# Altium project PAY_IFB.PrjPcb (part 4 of 7)

## Sheet SAMA7D65_MPU.SchDoc
size A3; SheetNumber: 7; SheetTotal: 23
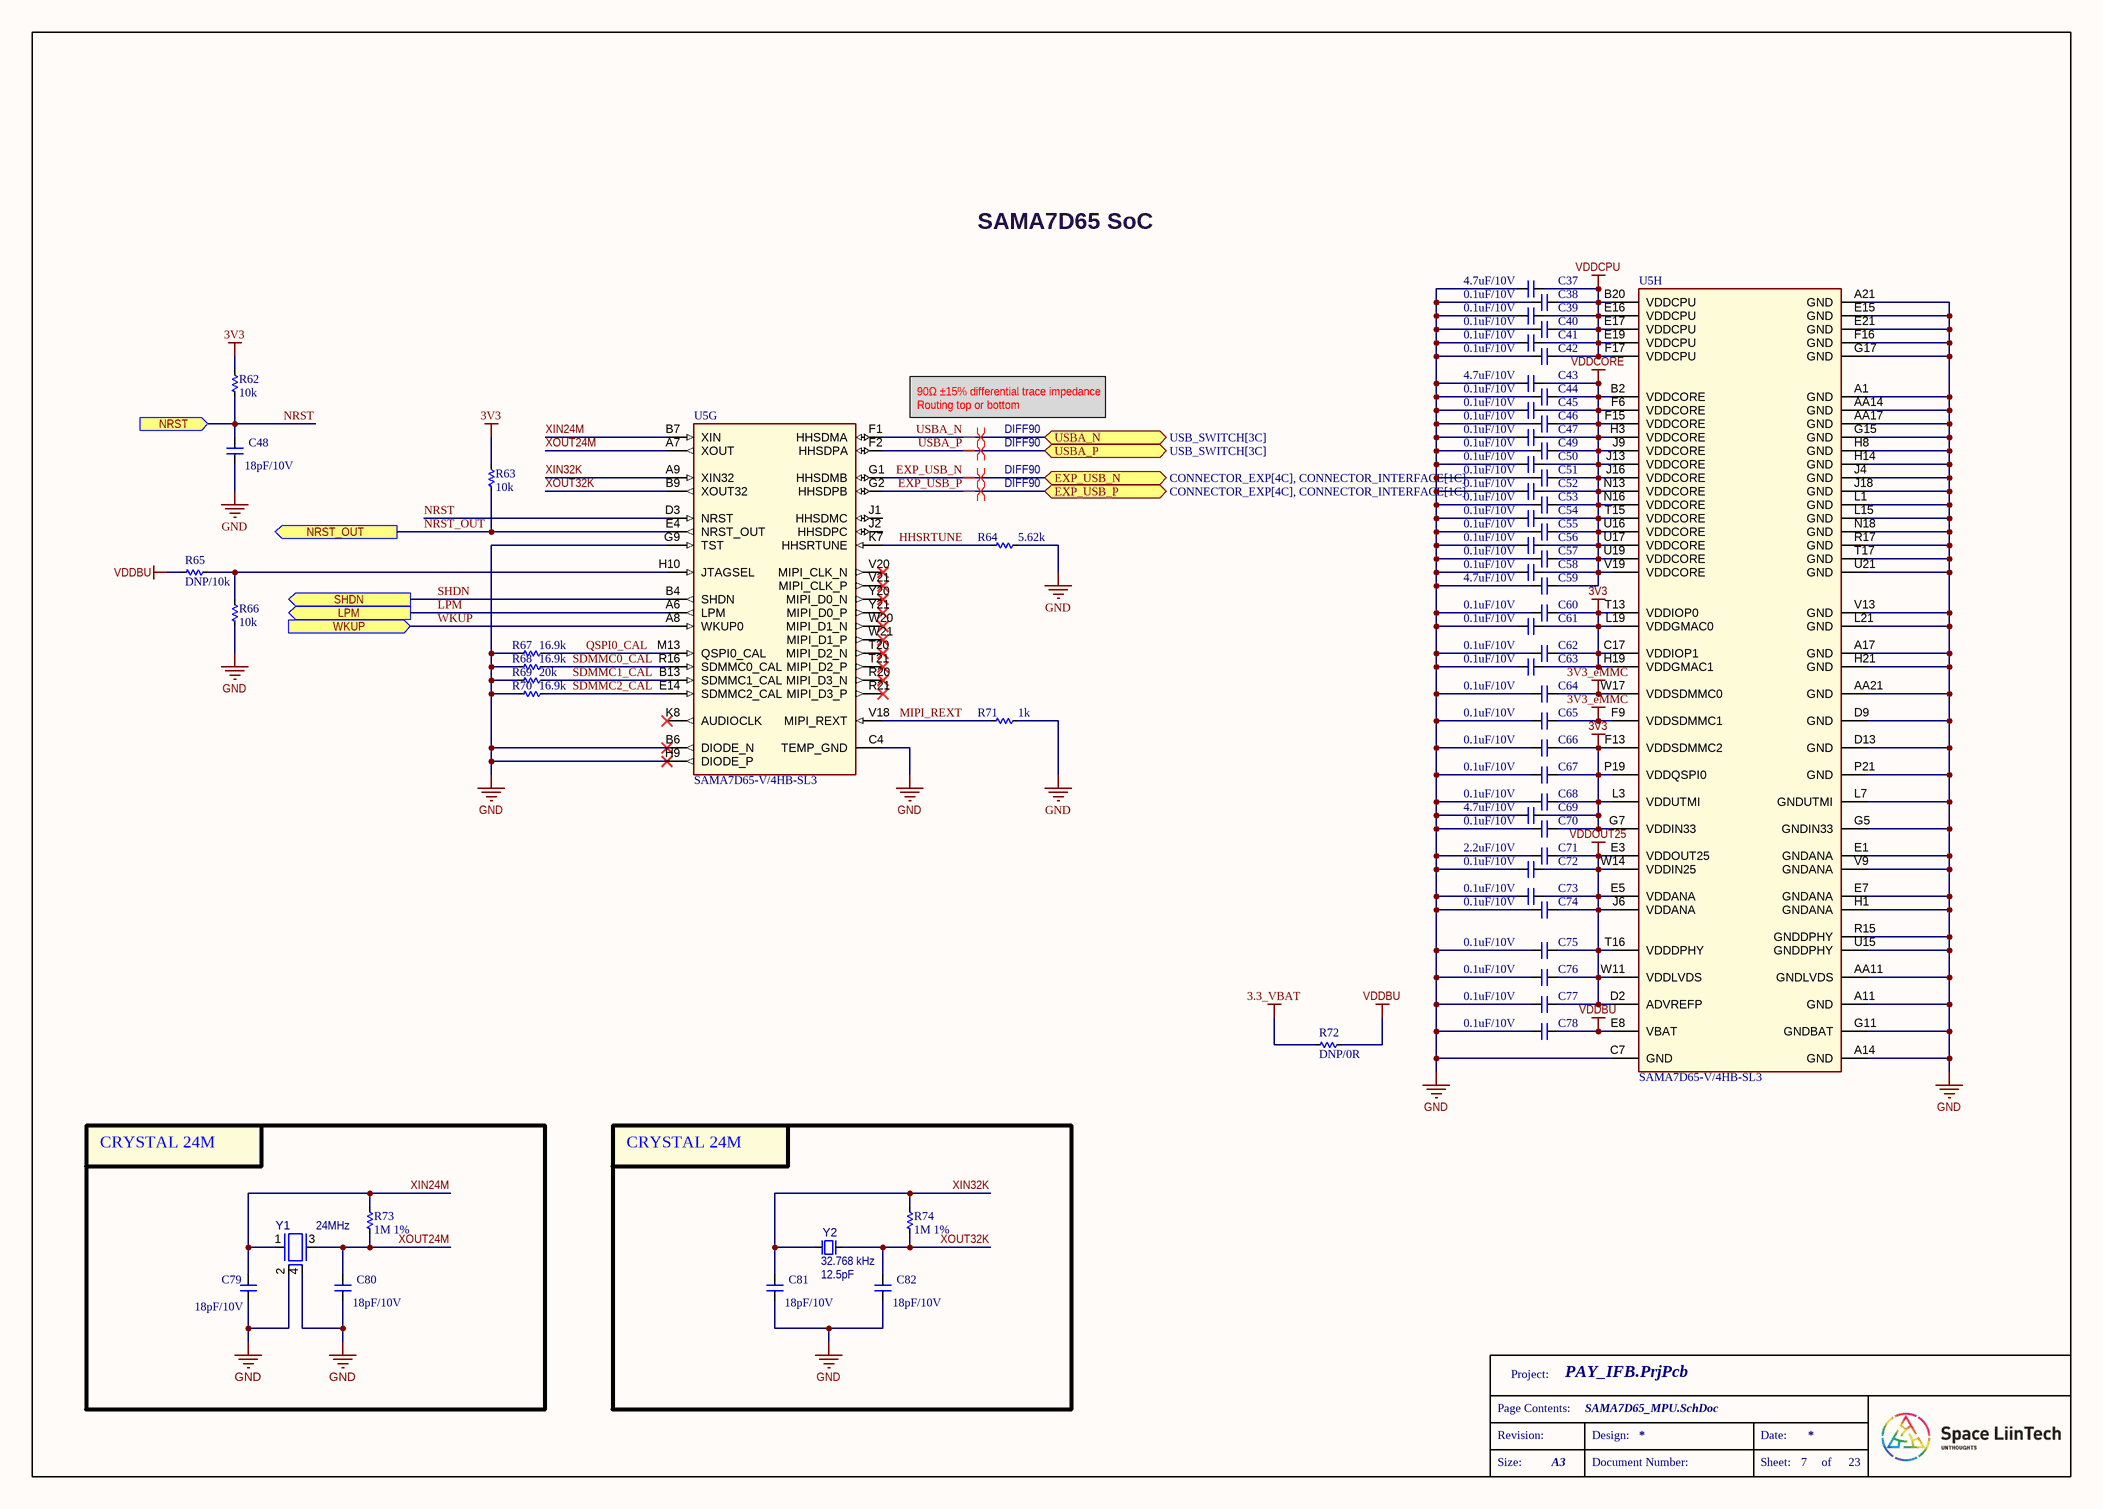
[diagram p7: SAMA7D65_MPU.SchDoc]

### Parts
C37  4.7uF/10V  [CAP_C_1005X50_L]
C38  0.1uF/10V  [CAP_C_0603x30]
C39  0.1uF/10V  [CAP_C_0603x30]
C40  0.1uF/10V  [CAP_C_0603x30]
C41  0.1uF/10V  [CAP_C_0603x30]
C42  0.1uF/10V  [CAP_C_0603x30]
C43  4.7uF/10V  [CAP_C_1005X50_L]
C44  0.1uF/10V  [CAP_C_0603x30]
C45  0.1uF/10V  [CAP_C_0603x30]
C46  0.1uF/10V  [CAP_C_0603x30]
C47  0.1uF/10V  [CAP_C_0603x30]
C48  18pF/10V  [CAP_C_0603x30]
C49  0.1uF/10V  [CAP_C_0603x30]
C50  0.1uF/10V  [CAP_C_0603x30]
C51  0.1uF/10V  [CAP_C_0603x30]
C52  0.1uF/10V  [CAP_C_0603x30]
C53  0.1uF/10V  [CAP_C_0603x30]
C54  0.1uF/10V  [CAP_C_0603x30]
C55  0.1uF/10V  [CAP_C_0603x30]
C56  0.1uF/10V  [CAP_C_0603x30]
C57  0.1uF/10V  [CAP_C_0603x30]
C58  0.1uF/10V  [CAP_C_0603x30]
C59  4.7uF/10V  [CAP_C_1005X50_L]
C60  0.1uF/10V  [CAP_C_0603x30]
C61  0.1uF/10V  [CAP_C_0603x30]
C62  0.1uF/10V  [CAP_C_0603x30]
C63  0.1uF/10V  [CAP_C_0603x30]
C64  0.1uF/10V  [CAP_C_0603x30]
C65  0.1uF/10V  [CAP_C_0603x30]
C66  0.1uF/10V  [CAP_C_0603x30]
C67  0.1uF/10V  [CAP_C_0603x30]
C68  0.1uF/10V  [CAP_C_0603x30]
C69  4.7uF/10V  [CAP_C_1005X50_L]
C70  0.1uF/10V  [CAP_C_0603x30]
C71  2.2uF/10V  [CAP_C_1005X50_L]
C72  0.1uF/10V  [CAP_C_0603x30]
C73  0.1uF/10V  [CAP_C_0603x30]
C74  0.1uF/10V  [CAP_C_0603x30]
C75  0.1uF/10V  [CAP_C_0603x30]
C76  0.1uF/10V  [CAP_C_0603x30]
C77  0.1uF/10V  [CAP_C_0603x30]
C78  0.1uF/10V  [CAP_C_0603x30]
C79  18pF/10V  [CAP_C_0603x30]
C80  18pF/10V  [CAP_C_0603x30]
C81  18pF/10V  [CAP_C_0603x30]
C82  18pF/10V  [CAP_C_0603x30]
R62  10k  [RES_C_1005x30_L]
R63  10k  [RES_C_1005x30_L]
R64  5.62k  [RES_C_1005x30_L]
R65  DNP/10k  [RES_C_1005x30_L]
R66  10k  [RES_C_1005x30_L]
R67  16.9k  [RES_C_0603X30]
R68  16.9k  [RES_C_0603X30]
R69  20k  [RES_C_0603X30]
R70  16.9k  [RES_C_0603X30]
R71  1k  [RES_C_1005x30_L]
R72  DNP/0R  [RES_C_1005x30_L]
R73  1M 1%  [RES_C_1005x30_L]
R74  1M 1%  [RES_C_1005x30_L]
U5  value SAMA7D65-V/4HB-SL3  [TFBGA-343_14x14]  (hidden comment: SAMA7D65)  (parts G,H of 8)
Y1  value 24MHz  [XTAL_ECS2401037B2JTNTR]  (hidden comment: Crystal 4 Pins)
Y2  value 32.768 kHz  Load Capacitance: 12.5pF  [CRYSTAL_FC-12M_L2.05W1.2H0.6]  (hidden comment: Crystal 2 Pins)

### Blocks framed on the sheet
CRYSTAL 24M: C79 C80 R73 Y1
CRYSTAL 24M: C81 C82 R74 Y2

### Ports
EXP_USB_N (bidir, see CONNECTOR_EXP[4C], CONNECTOR_INTERFACE[1C]), EXP_USB_P (bidir, see CONNECTOR_EXP[4C], CONNECTOR_INTERFACE[1C]), LPM (out, see SAMA7D65_PMIC[1A]), NRST (in, see BUTTON_LED[6B], SAMA7D65_PMIC[1B], WATCHDOG[5B]), NRST_OUT (out), SHDN (out, see SAMA7D65_PMIC[1A]), USBA_N (bidir, see USB_SWITCH[3C]), USBA_P (bidir, see USB_SWITCH[3C]), WKUP (in, see SAMA7D65_PMIC[1B])

### Nets
3.3_VBAT: R72.1
3V3: C60.2 C61.2 C62.2 C63.2 C66.2 C67.2 C68.2 C69.2 C70.2 R62.1 R63.1 U5.C17(VDDIOP1) U5.F13(VDDSDMMC2) U5.G7(VDDIN33) U5.H19(VDDGMAC1) U5.L3(VDDUTMI) U5.L19(VDDGMAC0) U5.P19(VDDQSPI0) U5.T13(VDDIOP0)
3V3_eMMC: C64.2 C65.2 U5.F9(VDDSDMMC1) U5.W17(VDDSDMMC0)
GND: C37.1 C38.1 C39.1 C40.1 C41.1 C42.1 C43.1 C44.1 C45.1 C46.1 C47.1 C48.2 C49.1 C50.1 C51.1 C52.1 C53.1 C54.1 C55.1 C56.1 C57.1 C58.1 C59.1 C60.1 C61.1 C62.1 C63.1 C64.1 C65.1 C66.1 C67.1 C68.1 C69.1 C70.1 C71.1 C72.1 C73.1 C74.1 C75.1 C76.1 C77.1 C78.1 C79.2 C80.2 C81.2 C82.2 R64.2 R66.1 R67.1 R68.1 R69.1 R70.1 R71.2 U5.A1(GND) U5.A11(GND) U5.A14(GND) U5.A17(GND) U5.A21(GND) U5.AA11(GNDLVDS) U5.AA14(GND) U5.AA17(GND) U5.AA21(GND) U5.B6(DIODE_N) U5.C4(TEMP_GND) U5.C7(GND) U5.D9(GND) U5.D13(GND) U5.E1(GNDANA) U5.E7(GNDANA) U5.E15(GND) U5.E21(GND) U5.F16(GND) U5.G5(GNDIN33) U5.G9(TST) U5.G11(GNDBAT) U5.G15(GND) U5.G17(GND) U5.H1(GNDANA) U5.H8(GND) U5.H9(DIODE_P) U5.H14(GND) U5.H21(GND) U5.J4(GND) U5.J18(GND) U5.L1(GND) U5.L7(GNDUTMI) U5.L15(GND) U5.L21(GND) U5.N18(GND) U5.P21(GND) U5.R15(GNDDPHY) U5.R17(GND) U5.T17(GND) U5.U15(GNDDPHY) U5.U21(GND) U5.V9(GNDANA) U5.V13(GND) Y1.2(GND) Y1.4(GND)
VDDBU: C78.2 R65.2 R72.2 U5.E8(VBAT)
VDDCORE: C43.2 C44.2 C45.2 C46.2 C47.2 C49.2 C50.2 C51.2 C52.2 C53.2 C54.2 C55.2 C56.2 C57.2 C58.2 C59.2 U5.B2(VDDCORE) U5.F6(VDDCORE) U5.F15(VDDCORE) U5.H3(VDDCORE) U5.J9(VDDCORE) U5.J13(VDDCORE) U5.J16(VDDCORE) U5.N13(VDDCORE) U5.N16(VDDCORE) U5.T15(VDDCORE) U5.U16(VDDCORE) U5.U17(VDDCORE) U5.U19(VDDCORE) U5.V19(VDDCORE)
VDDCPU: C37.2 C38.2 C39.2 C40.2 C41.2 C42.2 U5.B20(VDDCPU) U5.E16(VDDCPU) U5.E17(VDDCPU) U5.E19(VDDCPU) U5.F17(VDDCPU)
VDDOUT25: C71.2 C72.2 C73.2 C74.2 C75.2 C76.2 C77.2 U5.D2(ADVREFP) U5.E3(VDDOUT25) U5.E5(VDDANA) U5.J6(VDDANA) U5.T16(VDDDPHY) U5.W11(VDDLVDS) U5.W14(VDDIN25)
EXP_USB_N: U5.G1(HHSDMB) ; port EXP_USB_N
EXP_USB_P: U5.G2(HHSDPB) ; port EXP_USB_P
HHSRTUNE: R64.1 U5.K7(HHSRTUNE)
LPM: U5.A6(LPM) ; port LPM
MIPI_REXT: R71.1 U5.V18(MIPI_REXT)
NRST: C48.1 R62.2 U5.D3(NRST) ; port NRST
NRST_OUT: R63.2 U5.E4(NRST_OUT) ; port NRST_OUT
QSPI0_CAL: R67.2 U5.M13(QSPI0_CAL)
SDMMC0_CAL: R68.2 U5.R16(SDMMC0_CAL)
SDMMC1_CAL: R69.2 U5.B13(SDMMC1_CAL)
SDMMC2_CAL: R70.2 U5.E14(SDMMC2_CAL)
SHDN: U5.B4(SHDN) ; port SHDN
USBA_N: U5.F1(HHSDMA) ; port USBA_N
USBA_P: U5.F2(HHSDPA) ; port USBA_P
WKUP: U5.A8(WKUP0) ; port WKUP
XIN24M: C79.1 R73.2 U5.B7(XIN) Y1.1(Osc1)
XIN32K: C81.1 R74.2 U5.A9(XIN32) Y2.1(Osc1)
XOUT24M: C80.1 R73.1 U5.A7(XOUT) Y1.3(Osc2)
XOUT32K: C82.1 R74.1 U5.B9(XOUT32) Y2.2(Osc2)
NetR65_1: R65.1 R66.2 U5.H10(JTAGSEL)

Not connected (* = marked no-connect by the designer): U5 J1(HHSDMC) J2(HHSDPC) K8(AUDIOCLK)* R20(MIPI_D3_N)* R21(MIPI_D3_P)* T20(MIPI_D2_N)* T21(MIPI_D2_P)* V20(MIPI_CLK_N)* V21(MIPI_CLK_P)* W20(MIPI_D1_N)* W21(MIPI_D1_P)* Y20(MIPI_D0_N)* Y21(MIPI_D0_P)*

### Layout directives
differential pair; differential pair class DIFF90; net class DIFF90; rule Matched Net Lengths [Tolerance = 4mil]: EXP_USB_N, EXP_USB_P, USBA_N, USBA_P

### Notes on the sheet
- SAMA7D65 SoC
- 90Ω ±15% differential trace impedance
  Routing top or bottom
- Project:
- Page Contents:
- Revision:
- Design:
- Date:
- Size:
- A3
- Document Number:
- Sheet:
- of

### Library data of the parts
C37-C82 = _CAP_C_2: CAP CHIP
R62-R74 = _RES_B_2: RES
U5 = SAMA7D65: SAMA7D65 MPU 1000MHz Cortex-A7 TFBGA-343; Manufacturer 1: Microchip Technology; Description_: MCHP MPU 32-BIT Cortex-A7 1000MHz 128kB SAMA7D65-V/4HB-SL3 TFBGA-343; Populated: YES; MCHP-ID: IC2674; Symbol: SAMA7D65-TFBGA-343; Dev Tools Status: Design; Owner: Ciprian Abramov; Restricted Sourcing: No; Manufacturer Part Number 1: SAMA7D65-V/4HB-SL3; Type: 32-Bit MPU; Status: MCL Design; Revision: 1; Category: MCHP-Microcontroller; ComponentLink1URL: https://www.microchip.com/sitesearch/search/Product%20and%20Development%20Tools/SAMA7D65-V/4HB-SL3; ComponentLink1Description: SVN Datasheet; ComponentLink2Description: Local Datasheet; ComponentLink3URL: C:\ALTIUM_WORK\00001_MCHP-CDB\Library\LibraryRefs\SAMA7D65-TFBGA-343.SchLib; ComponentLink3Description: Open Symbol; ComponentLink4URL: C:\ALTIUM_WORK\00001_MCHP-CDB\Library\Footprints\TFBGA-343_14x14.PcbLib; ComponentLink4Description: Open Footprint; ComponentLink5Description: Open Footprint 2; ComponentLink6Description: Open Footprint 3; ComponentLink7Description: Open Footprint 4; Supplier 1: Microchip Technology; Supplier Part Number 1: SAMA7D65-V/4HB-SL3; Operating Temperature: -40C to +105C; Quantity Override: 1
Y1 = ECS-240-10-37B2-JTN-TR: CRYSTAL 24 MHZ 10PF SMD; Manufacturer 1: ECS Inc; MCHP-ID: OSC1299; Description_: CRYSTAL 24MHz 10pF SMD L2W1.6H0.5; Dev Tools Status: Design; Owner: Ciprian Abramov; Tolerance: 20ppm; Populated: YES; Revision: 1; Symbol: Crystal 4 Pins; Status: MCL Design; ComponentLink1URL: https://chn-vm-apps.microchip.com/mchprepo/parts/Datasheets/ECX-1637B2.pdf; ComponentLink1Description: SVN Datasheet; ComponentLink2URL: C:\ALTIUM_WORK\00001_MCHP-CDB\Datasheets\ECX-1637B2.pdf; ComponentLink2Description: Local Datasheet; ComponentLink3URL: C:\ALTIUM_WORK\00001_MCHP-CDB\Library\LibraryRefs\Crystal 4 Pins.SchLib; ComponentLink3Description: Open Symbol; ComponentLink4URL: C:\ALTIUM_WORK\00001_MCHP-CDB\Library\Footprints\CRYSTAL_L2.0W1.6H0.5_FA-128.PcbLib; ComponentLink4Description: Open Footprint; ComponentLink5Description: Open Footprint 2; ComponentLink6Description: Open Footprint 3; ComponentLink7Description: Open Footprint 4; Operating Temperature: -40C to +85C; Package: L2.0W1.6H0.5; Type: Crystal; Category: Crystal/Oscillator; Load Capacitance: 10pF; Manufacturer Part Number 1: ECS-240-10-37B2-JTN-TR; Supplier 1: Digi-Key; Supplier Part Number 1: 50-ECS-240-10-37B2-JTN-TR-ND; Quantity Override: 1
Y2 = FC-12M 32.7680KA-A3: CRYSTAL 32.7680KHZ 12.5PF SMD; Manufacturer 1: Epson; MCHP-ID: OSC1269; Description_: CRYSTAL 32.768KHZ 12.5PF SMD 2-SMD, No Lead, FC-12M 32.7680KA-A3; Dev Tools Status: Design; Owner: Dragos Danaila; Tolerance: 20ppm; Populated: YES; Revision: 1; Symbol: Crystal 2 Pins; Status: MCL Design; ComponentLink1URL: https://chn-vm-apps.microchip.com/mchprepo/parts/Datasheets/FC-12D_en.pdf; ComponentLink1Description: SVN Datasheet; ComponentLink2URL: C:\ALTIUM_WORK\00001_MCHP-CDB\Datasheets\FC-12D_en.pdf; ComponentLink2Description: Local Datasheet; ComponentLink3URL: C:\ALTIUM_WORK\00001_MCHP-CDB\Library\LibraryRefs\Crystal 2 Pins.SchLib; ComponentLink3Description: Open Symbol; ComponentLink4URL: C:\ALTIUM_WORK\00001_MCHP-CDB\Library\Footprints\CRYSTAL_FC-12M_L2.05W1.2H0.6.PcbLib; ComponentLink4Description: Open Footprint; ComponentLink5Description: Open Footprint 2; ComponentLink6Description: Open Footprint 3; ComponentLink7Description: Open Footprint 4; Operating Temperature: -40°C ~ 85°C; Package: 2-SMD, No Lead; Type: Crystal; Category: Crystal/Oscillator; Manufacturer Part Number 1: FC-12M 32.7680KA-A3; Supplier 1: Digikey; Supplier Part Number 1: SER3672CT-ND; Quantity Override: 1